# Altium schematic sheet LED_Matrix.SchDoc
size A3; SheetNumber: 4; SheetTotal: 5
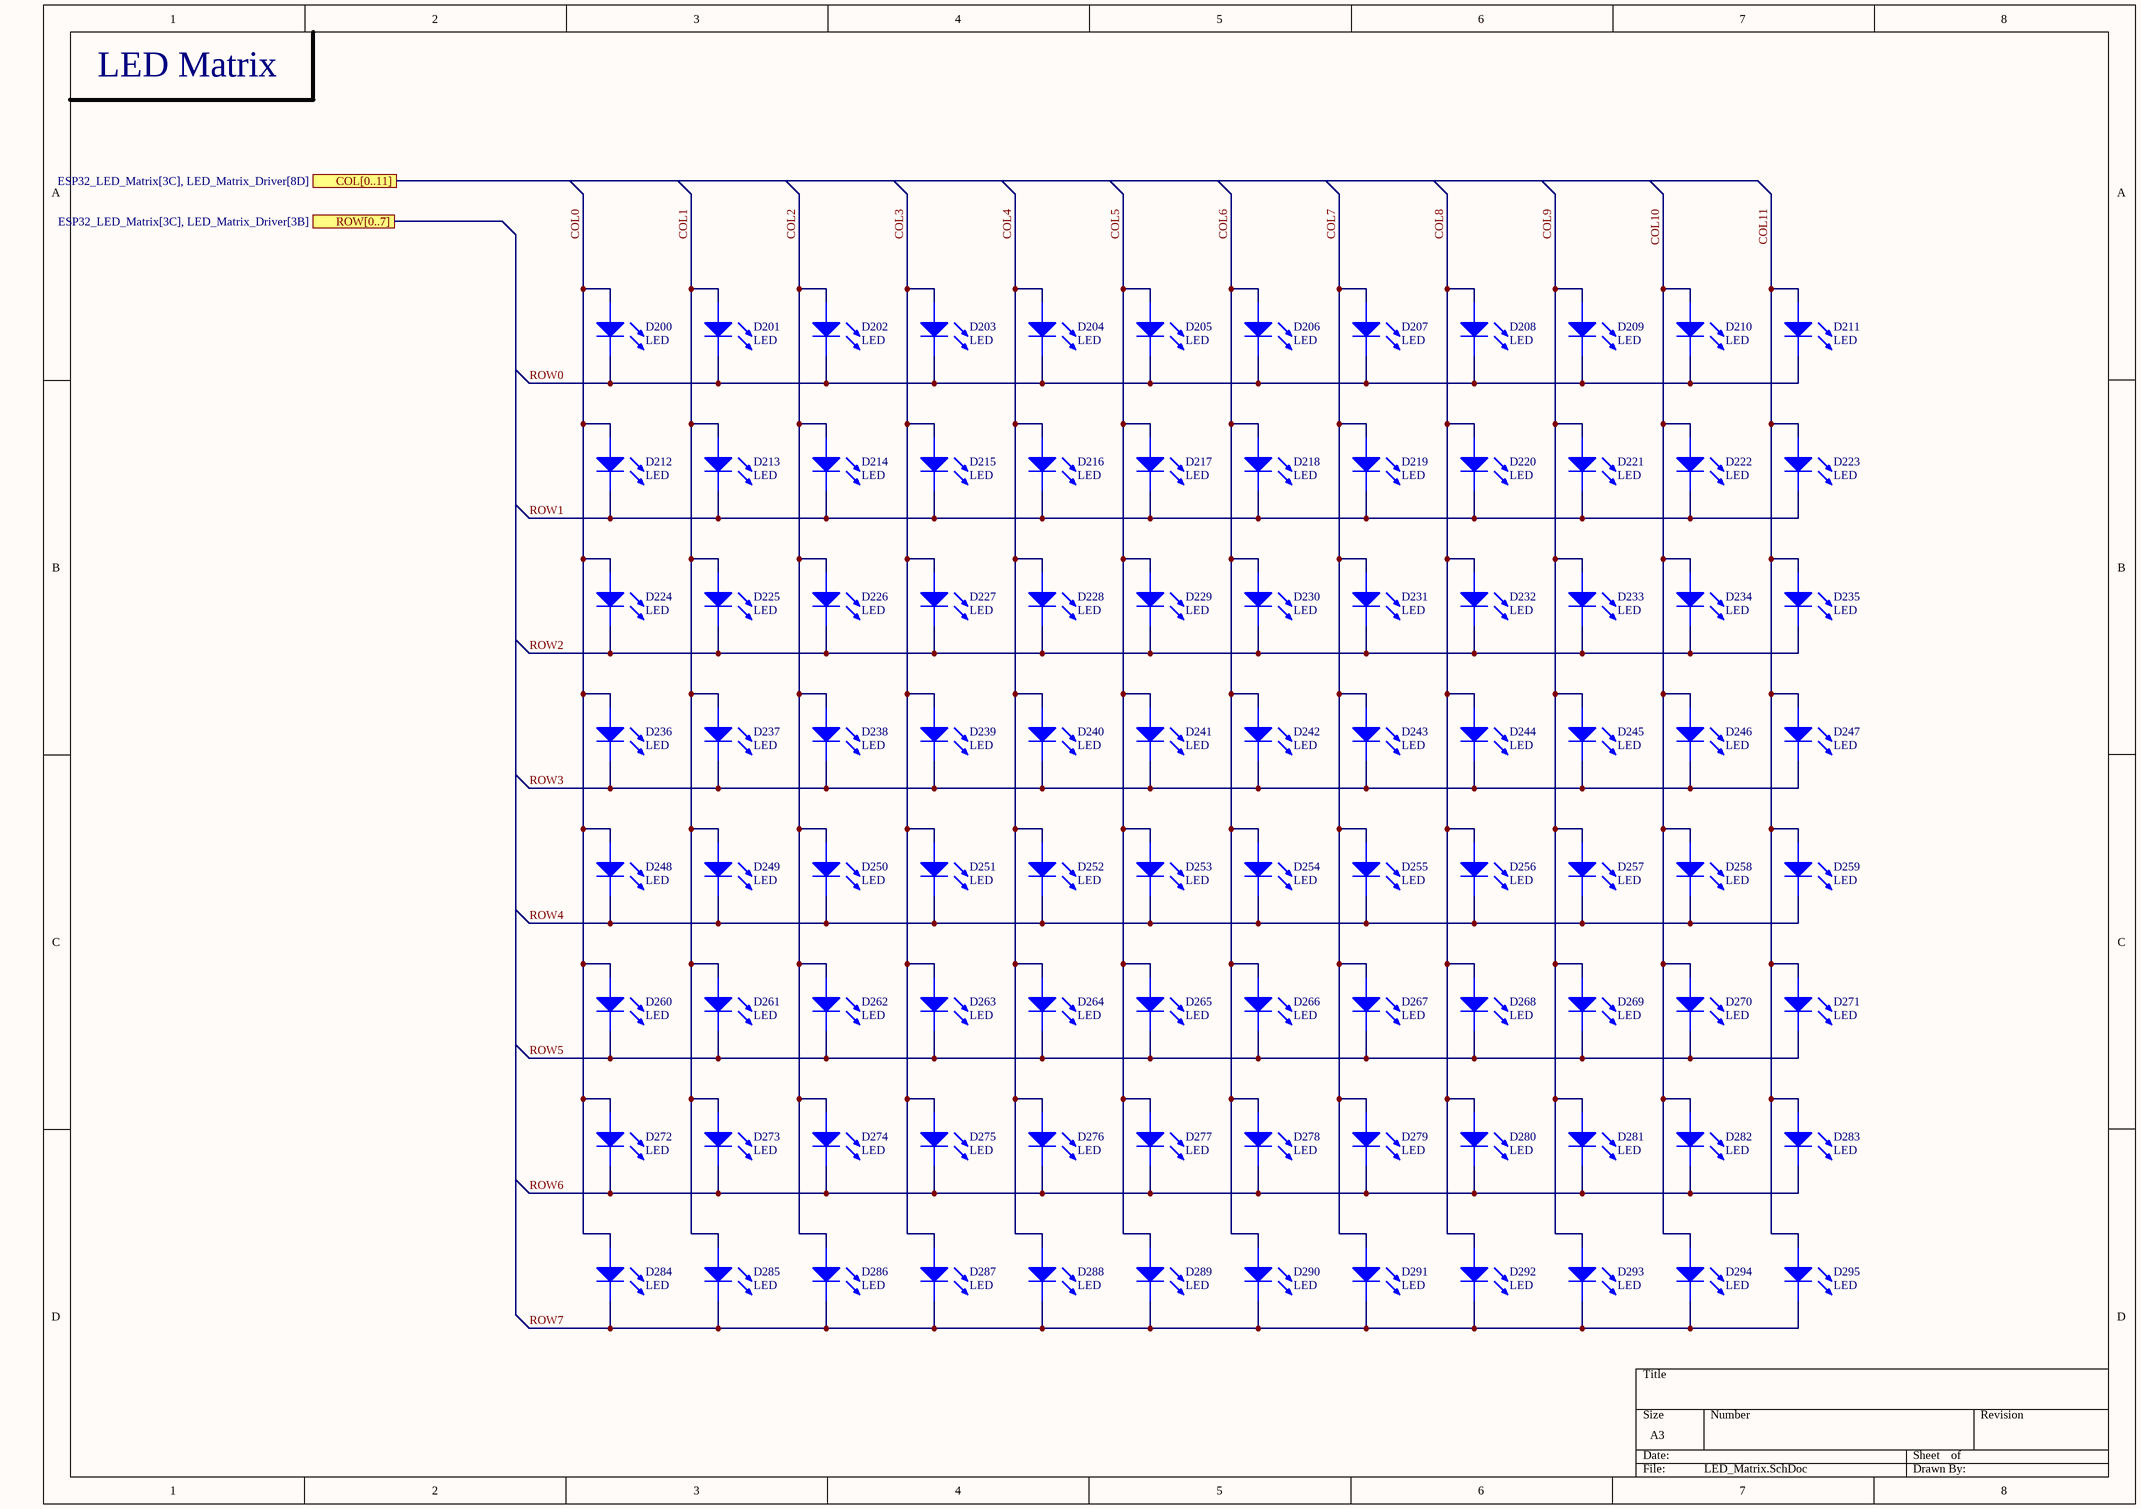
[diagram p0: LED_Matrix.SchDoc]

## Parts
D200  LED  [LEDM2012X80N]
D201  LED  [LEDM2012X80N]
D202  LED  [LEDM2012X80N]
D203  LED  [LEDM2012X80N]
D204  LED  [LEDM2012X80N]
D205  LED  [LEDM2012X80N]
D206  LED  [LEDM2012X80N]
D207  LED  [LEDM2012X80N]
D208  LED  [LEDM2012X80N]
D209  LED  [LEDM2012X80N]
D210  LED  [LEDM2012X80N]
D211  LED  [LEDM2012X80N]
D212  LED  [LEDM2012X80N]
D213  LED  [LEDM2012X80N]
D214  LED  [LEDM2012X80N]
D215  LED  [LEDM2012X80N]
D216  LED  [LEDM2012X80N]
D217  LED  [LEDM2012X80N]
D218  LED  [LEDM2012X80N]
D219  LED  [LEDM2012X80N]
D220  LED  [LEDM2012X80N]
D221  LED  [LEDM2012X80N]
D222  LED  [LEDM2012X80N]
D223  LED  [LEDM2012X80N]
D224  LED  [LEDM2012X80N]
D225  LED  [LEDM2012X80N]
D226  LED  [LEDM2012X80N]
D227  LED  [LEDM2012X80N]
D228  LED  [LEDM2012X80N]
D229  LED  [LEDM2012X80N]
D230  LED  [LEDM2012X80N]
D231  LED  [LEDM2012X80N]
D232  LED  [LEDM2012X80N]
D233  LED  [LEDM2012X80N]
D234  LED  [LEDM2012X80N]
D235  LED  [LEDM2012X80N]
D236  LED  [LEDM2012X80N]
D237  LED  [LEDM2012X80N]
D238  LED  [LEDM2012X80N]
D239  LED  [LEDM2012X80N]
D240  LED  [LEDM2012X80N]
D241  LED  [LEDM2012X80N]
D242  LED  [LEDM2012X80N]
D243  LED  [LEDM2012X80N]
D244  LED  [LEDM2012X80N]
D245  LED  [LEDM2012X80N]
D246  LED  [LEDM2012X80N]
D247  LED  [LEDM2012X80N]
D248  LED  [LEDM2012X80N]
D249  LED  [LEDM2012X80N]
D250  LED  [LEDM2012X80N]
D251  LED  [LEDM2012X80N]
D252  LED  [LEDM2012X80N]
D253  LED  [LEDM2012X80N]
D254  LED  [LEDM2012X80N]
D255  LED  [LEDM2012X80N]
D256  LED  [LEDM2012X80N]
D257  LED  [LEDM2012X80N]
D258  LED  [LEDM2012X80N]
D259  LED  [LEDM2012X80N]
D260  LED  [LEDM2012X80N]
D261  LED  [LEDM2012X80N]
D262  LED  [LEDM2012X80N]
D263  LED  [LEDM2012X80N]
D264  LED  [LEDM2012X80N]
D265  LED  [LEDM2012X80N]
D266  LED  [LEDM2012X80N]
D267  LED  [LEDM2012X80N]
D268  LED  [LEDM2012X80N]
D269  LED  [LEDM2012X80N]
D270  LED  [LEDM2012X80N]
D271  LED  [LEDM2012X80N]
D272  LED  [LEDM2012X80N]
D273  LED  [LEDM2012X80N]
D274  LED  [LEDM2012X80N]
D275  LED  [LEDM2012X80N]
D276  LED  [LEDM2012X80N]
D277  LED  [LEDM2012X80N]
D278  LED  [LEDM2012X80N]
D279  LED  [LEDM2012X80N]
D280  LED  [LEDM2012X80N]
D281  LED  [LEDM2012X80N]
D282  LED  [LEDM2012X80N]
D283  LED  [LEDM2012X80N]
D284  LED  [LEDM2012X80N]
D285  LED  [LEDM2012X80N]
D286  LED  [LEDM2012X80N]
D287  LED  [LEDM2012X80N]
D288  LED  [LEDM2012X80N]
D289  LED  [LEDM2012X80N]
D290  LED  [LEDM2012X80N]
D291  LED  [LEDM2012X80N]
D292  LED  [LEDM2012X80N]
D293  LED  [LEDM2012X80N]
D294  LED  [LEDM2012X80N]
D295  LED  [LEDM2012X80N]

## Ports
COL[0..11] (see ESP32_LED_Matrix[3C], LED_Matrix_Driver[8D]), ROW[0..7] (see ESP32_LED_Matrix[3C], LED_Matrix_Driver[3B])

## Nets
COL0: D200.2(A) D212.2(A) D224.2(A) D236.2(A) D248.2(A) D260.2(A) D272.2(A) D284.2(A)
COL1: D201.2(A) D213.2(A) D225.2(A) D237.2(A) D249.2(A) D261.2(A) D273.2(A) D285.2(A)
COL2: D202.2(A) D214.2(A) D226.2(A) D238.2(A) D250.2(A) D262.2(A) D274.2(A) D286.2(A)
COL3: D203.2(A) D215.2(A) D227.2(A) D239.2(A) D251.2(A) D263.2(A) D275.2(A) D287.2(A)
COL4: D204.2(A) D216.2(A) D228.2(A) D240.2(A) D252.2(A) D264.2(A) D276.2(A) D288.2(A)
COL5: D205.2(A) D217.2(A) D229.2(A) D241.2(A) D253.2(A) D265.2(A) D277.2(A) D289.2(A)
COL6: D206.2(A) D218.2(A) D230.2(A) D242.2(A) D254.2(A) D266.2(A) D278.2(A) D290.2(A)
COL7: D207.2(A) D219.2(A) D231.2(A) D243.2(A) D255.2(A) D267.2(A) D279.2(A) D291.2(A)
COL8: D208.2(A) D220.2(A) D232.2(A) D244.2(A) D256.2(A) D268.2(A) D280.2(A) D292.2(A)
COL9: D209.2(A) D221.2(A) D233.2(A) D245.2(A) D257.2(A) D269.2(A) D281.2(A) D293.2(A)
COL10: D210.2(A) D222.2(A) D234.2(A) D246.2(A) D258.2(A) D270.2(A) D282.2(A) D294.2(A)
COL11: D211.2(A) D223.2(A) D235.2(A) D247.2(A) D259.2(A) D271.2(A) D283.2(A) D295.2(A)
ROW0: D200.1(K) D201.1(K) D202.1(K) D203.1(K) D204.1(K) D205.1(K) D206.1(K) D207.1(K) D208.1(K) D209.1(K) D210.1(K) D211.1(K)
ROW1: D212.1(K) D213.1(K) D214.1(K) D215.1(K) D216.1(K) D217.1(K) D218.1(K) D219.1(K) D220.1(K) D221.1(K) D222.1(K) D223.1(K)
ROW2: D224.1(K) D225.1(K) D226.1(K) D227.1(K) D228.1(K) D229.1(K) D230.1(K) D231.1(K) D232.1(K) D233.1(K) D234.1(K) D235.1(K)
ROW3: D236.1(K) D237.1(K) D238.1(K) D239.1(K) D240.1(K) D241.1(K) D242.1(K) D243.1(K) D244.1(K) D245.1(K) D246.1(K) D247.1(K)
ROW4: D248.1(K) D249.1(K) D250.1(K) D251.1(K) D252.1(K) D253.1(K) D254.1(K) D255.1(K) D256.1(K) D257.1(K) D258.1(K) D259.1(K)
ROW5: D260.1(K) D261.1(K) D262.1(K) D263.1(K) D264.1(K) D265.1(K) D266.1(K) D267.1(K) D268.1(K) D269.1(K) D270.1(K) D271.1(K)
ROW6: D272.1(K) D273.1(K) D274.1(K) D275.1(K) D276.1(K) D277.1(K) D278.1(K) D279.1(K) D280.1(K) D281.1(K) D282.1(K) D283.1(K)
ROW7: D284.1(K) D285.1(K) D286.1(K) D287.1(K) D288.1(K) D289.1(K) D290.1(K) D291.1(K) D292.1(K) D293.1(K) D294.1(K) D295.1(K)

## Notes on the sheet
- LED Matrix

## Library data of the parts
D200-D295 = LED: General Purpose LED; ComponentLink1Description: Datasheet; ComponentLink1URL: https://www.smc-diodes.com/propdf/1N4148W%20N0571%20REV.E.pdf